# EAGLE design TestRig1a (EAGLE 7.5.0)

## Sheet 1 of 2
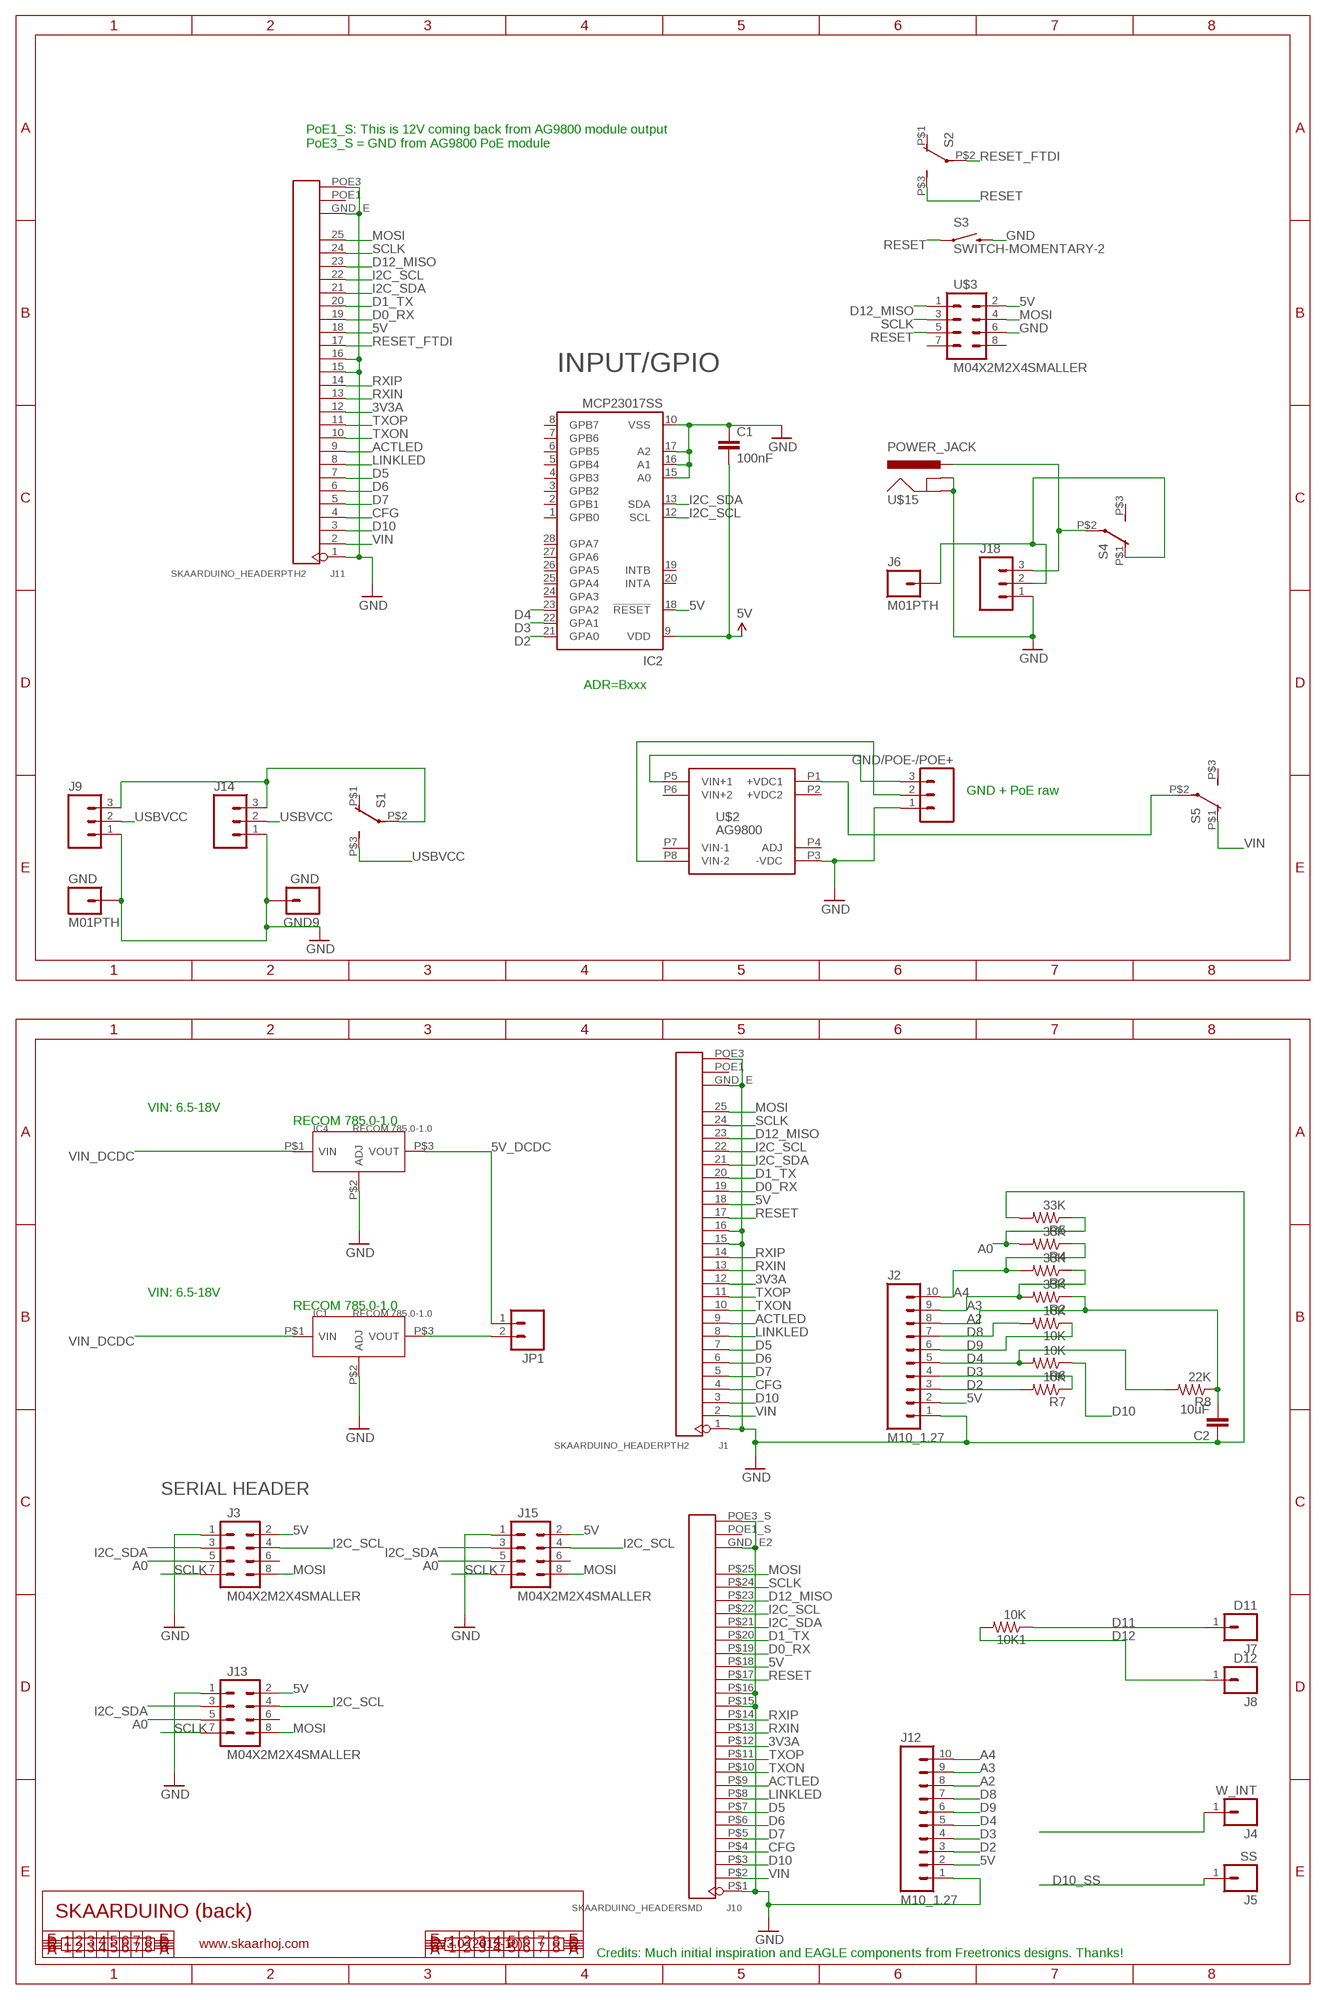
[diagram p0: schematic, sheet 1]

### Parts
10K  10K  RESISTOR0603-RES  [0603-RES]
10K1  10K  RESISTOR0603-RES  [0603-RES]
C1  100nF  CAP0603-CAP  [0603-CAP]
C2  10uF  CAP0805  [0805]
GND  M01PTH  [1X01]
GND9  GND  M01PTH  [1X01]
GND/POE-/POE+  M03LOCK  [1X03_LOCK]
IC1  RECOM 785.0-1.0  PMIC-LM317EMP  [RECOM_785.0-1.0]
IC2  MCP23017SS  [SSOP28]
IC4  RECOM 785.0-1.0  PMIC-LM317EMP  [RECOM_785.0-1.0]
J1  SKAARDUINO_HEADERPTH2  [SKAARDUINO_PTH_HEADER2]
J2  M10_1.27  [M10X1]
J3  M04X2M2X4SMALLER  [M2X4SMALLER]
J4  W_INT  M1X1TEST  [M1X1]
J5  SS  M1X1TEST  [M1X1]
J6  M01PTH  [1X01]
J7  D11  M1X1TEST  [M1X1]
J8  D12  M1X1TEST  [M1X1]
J9  M03LOCK  [1X03_LOCK]
J10  SKAARDUINO_HEADERSMD  [SKAARDUINO_SMD_HEADER]
J11  SKAARDUINO_HEADERPTH2  [SKAARDUINO_PTH_HEADER2]
J12  M10_1.27  [M10X1]
J13  M04X2M2X4SMALLER  [M2X4SMALLER]
J14  M03LOCK  [1X03_LOCK]
J15  M04X2M2X4SMALLER  [M2X4SMALLER]
J18  M03LOCK  [1X03_LOCK]
JP1  M02PTH  [1X02]
R2  33K  RESISTOR0603-RES  [0603-RES]
R3  33K  RESISTOR0603-RES  [0603-RES]
R4  33K  RESISTOR0603-RES  [0603-RES]
R5  33K  RESISTOR0603-RES  [0603-RES]
R6  10K  RESISTOR0603-RES  [0603-RES]
R7  10K  RESISTOR0603-RES  [0603-RES]
R8  22K  RESISTOR0603-RES  [0603-RES]
S1  SWITCH-DPST  [TECONNECTIVITY-DPST]
S2  SWITCH-DPST  [TECONNECTIVITY-DPST]
S3  SWITCH-MOMENTARY-2  [TACTILE_SWITCH_TALL]
S4  SWITCH-DPST  [TECONNECTIVITY-DPST]
S5  SWITCH-DPST  [TECONNECTIVITY-DPST]
U$2  AG9800  [AG9800]
U$3  M04X2M2X4SMALLER  [M2X4SMALLER]
U$15  POWER_JACK  [POWER_JACK_SMD]

### Nets
3V3A [power]: J1.12 J10.P$12 J11.12
5V [power]: C1.2 IC2.9(VDD) IC2.18(!RESET) J1.18 J2.2 J3.2 J10.P$18 J11.18 J12.2 J13.2 J15.2 U$3.2
5V_DCDC [power]: IC4.P$3(VOUT) JP1.1
A0: J3.5 J13.5 J15.5 R4.2 R5.1
A2: C2.2 J2.8 J12.8 R2.1 R8.1
A3: J2.9 J12.9 R2.2 R3.1
A4: J2.10 J12.10 R3.2 R4.1
ACTLED: J1.9 J10.P$9 J11.9
CFG: J1.4 J10.P$4 J11.4
D0_RX: J1.19 J10.P$19 J11.19
D1_TX: J1.20 J10.P$20 J11.20
D2: IC2.21(GPA0) J2.3 J12.3 R7.2
D3: IC2.22(GPA1) J2.4 J12.4 R7.1
D4: IC2.23(GPA2) J2.5 J12.5 R6.2 R8.2
D5: J1.7 J10.P$7 J11.7
D6: J1.6 J10.P$6 J11.6
D7: J1.5 J10.P$5 J11.5
D8: 10K.2 J2.7 J12.7
D9: 10K.1 J2.6 J12.6
D10: J1.3 J10.P$3 J11.3 R6.1
D10_SS: J5.1
D11: 10K1.1 J7.1
D12: 10K1.2 J8.1
D12_MISO: J1.23 J10.P$23 J11.23 U$3.1
GND [power]: C1.1 C2.1 GND9.1 GND.1 GND/POE-/POE+.1 IC1.P$2(ADJ) IC2.10(VSS) IC2.15(A0) IC2.16(A1) IC2.17(A2) IC4.P$2(ADJ) J1.1 J1.15 J1.16 J1.GND_E J1.POE3 J2.1 J3.1 J9.1 J10.GND_E2 J10.P$1 J10.P$15 J10.P$16 J10.POE3_S J11.1 J11.15 J11.16 J11.GND_E J11.POE3 J12.1 J13.1 J14.1 J15.1 J18.1 R5.2 S3.B2 U$2.P3(-VDC) U$3.6 U$15.GND U$15.SHUNT(GNDBREAK)
I2C_SCL: IC2.12(SCL) J1.22 J3.4 J10.P$22 J11.22 J13.4 J15.4
I2C_SDA: IC2.13(SDA) J1.21 J3.3 J10.P$21 J11.21 J13.3 J15.3
LINKLED: J1.8 J10.P$8 J11.8
MOSI: J1.25 J3.8 J10.P$25 J11.25 J13.8 J15.8 U$3.4
N$2 [VIN]: J18.3 S4.P$2(P) U$15.PWR
N$3: J4.1
N$5 [VIN]: S5.P$2(P) U$2.P1(+VDC1)
N$6 [power]: IC1.P$3(VOUT) JP1.2
N$7 [VIN]: GND/POE-/POE+.2 U$2.P8(VIN-2)
N$8 [VIN]: GND/POE-/POE+.3 U$2.P5(VIN+1)
N$9 [power]: J9.3 J14.3 S1.P$2(P)
N$13 [VIN]: J6.1 J18.2 S4.P$1(O)
RESET: J1.17 J10.P$17 S2.P$3(S) S3.A2 U$3.5
RESET_FTDI: J11.17 S2.P$2(P)
RXIN: J1.13 J10.P$13 J11.13
RXIP: J1.14 J10.P$14 J11.14
SCLK: J1.24 J3.7 J10.P$24 J11.24 J13.7 J15.7 U$3.3
TXON: J1.10 J10.P$10 J11.10
TXOP: J1.11 J10.P$11 J11.11
USBVCC [VIN]: J9.2 J14.2 S1.P$3(S)
VIN [VIN]: J1.2 J10.P$2 J11.2 S5.P$1(O)
VIN_DCDC [VIN]: IC1.P$1(VIN) IC4.P$1(VIN)
Unconnected: IC2.1(GPB0) IC2.2(GPB1) IC2.3(GPB2) IC2.4(GPB3) IC2.5(GPB4) IC2.6(GPB5) IC2.7(GPB6) IC2.8(GPB7) IC2.19(INTB) IC2.20(INTA) IC2.24(GPA3) IC2.25(GPA4) IC2.26(GPA5) IC2.27(GPA6) IC2.28(GPA7) J1.POE1 J3.6 J10.POE1_S J11.POE1 J13.6 J15.6 S1.P$1(O) S2.P$1(O) S4.P$3(S) S5.P$3(S) U$2.P2(+VDC2) U$2.P4(ADJ) U$3.7 U$3.8

### Notes on the sheet
- PoE1_S: This is 12V coming back from AG9800 module output
  PoE3_S = GND from AG9800 PoE module
- INPUT/GPIO
- ADR=Bxxx
- GND + PoE raw
- VIN: 6.5-18V
- RECOM 785.0-1.0
- VIN: 6.5-18V
- RECOM 785.0-1.0
- SERIAL HEADER
- SKAARDUINO (back)
- www.skaarhoj.com | V3.0 (2015-10)
- Credits: Much initial inspiration and EAGLE components from Freetronics designs. Thanks!

## Sheet 2 of 2

## Power pins joined to a net without a drawn wire
VIN+2: U$2.P6(VIN+2)
VIN-1: U$2.P7(VIN-1)

## Library data of the parts
10K 10K1 R2-R8 = SparkFun:RESISTOR: Resistor Basic schematic elements and footprints for 0603, 1206, and PTH resistors.
C1 C2 = SparkFun:CAP: Capacitor Standard 0603 ceramic capacitor, and 0.1" leaded capacitor.
GND GND9 J6 = SparkFun:M01: Header 1 Standard 1-pin 0.1" header. Use with straight break away headers (SKU : PRT-00116), right angle break away headers (PRT-00553), swiss pins (PRT-00743), machine pins (PRT-00117), and female headers (PRT-00115).
GND/POE-/POE+ J9 J14 J18 = SparkFun:M03: Header 3 Standard 3-pin 0.1" header. Use with straight break away headers (SKU : PRT-00116), right angle break away headers (PRT-00553), swiss pins (PRT-00743), machine pins (PRT-00117), and female headers (PRT-00115). Molex polarized connector foot print use with SKU : PRT-08232 with associated crimp pins and housings.
IC1 IC4 = SKAARHOJ:PMIC-LM317EMP: 3-Terminal Adjustable Regulator
IC2 = microchip:MCP23017: http://ww1.microchip.com/downloads/en/DeviceDoc/21952a.pdf Source: http://ww1.microchip.com/downloads/en/DeviceDoc/21952a.pdf; MF: MICROCHIP; MPN: MCP23017-E/SS; OC_FARNELL: 1467674; OC_NEWARK: 31K2960
J1 J10 J11 = SKAARHOJ:SKAARDUINO_HEADER
J2 J12 = SKAARHOJ:M10_1.27
J3 J13 J15 U$3 = SKAARHOJ:M04X2
J4 J5 J7 J8 = SKAARHOJ:M1X1
JP1 = SparkFun:M02: Header 2 Standard 2-pin 0.1" header. Use with straight break away headers (SKU : PRT-00116), right angle break away headers (PRT-00553), swiss pins (PRT-00743), machine pins (PRT-00117), and female headers (PRT-00115). Molex polarized connector foot print use with SKU : PRT-08233 with associated crimp pins and housings.
S1 S2 S4 S5 = SKAARHOJ:SWITCH-DPST: DPDT Version of the COM-00597
S3 = SparkFun:SWITCH-MOMENTARY-2
U$2 = SKAARHOJ:AG9800
U$15 = SKAARHOJ:POWER_JACK: RASM712PX Right Angle SMT Mount DC Power Jack, pin size 0.100"(2.5mm), with locating post Switchcraft.com

## Net classes
0 default: width 0.254 mm, clearance 0.152 mm
1 power: width 0.406 mm, clearance 0.152 mm
2 VIN: width 0.406 mm, clearance 0.406 mm

## Board
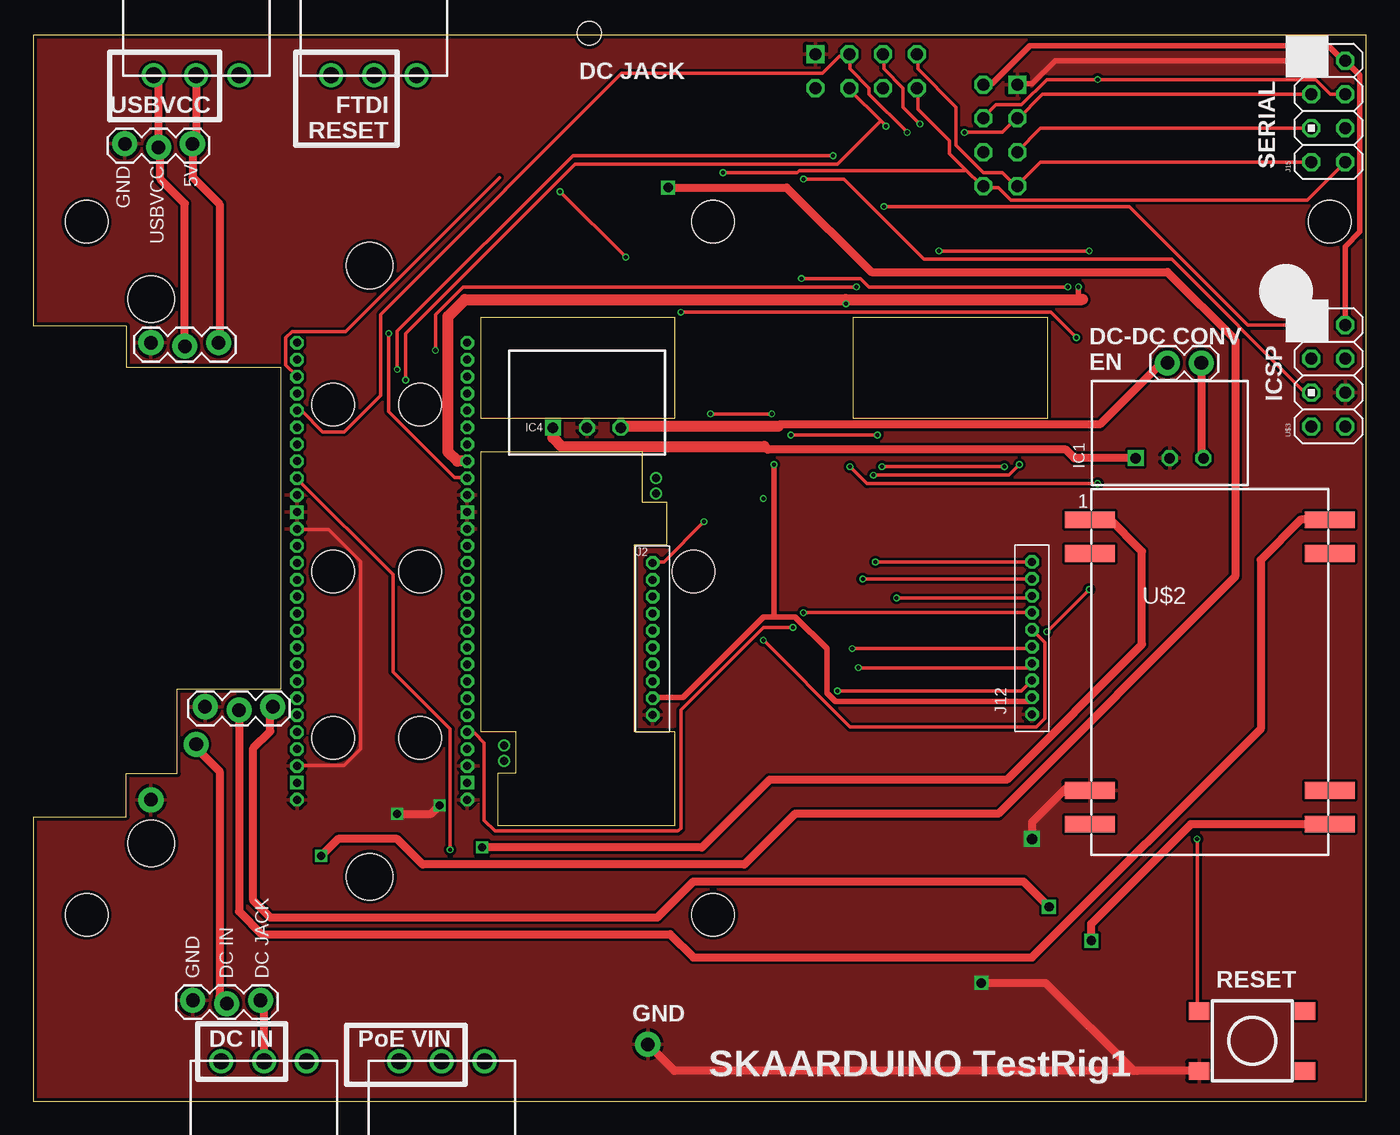
[diagram p1: board, top side]
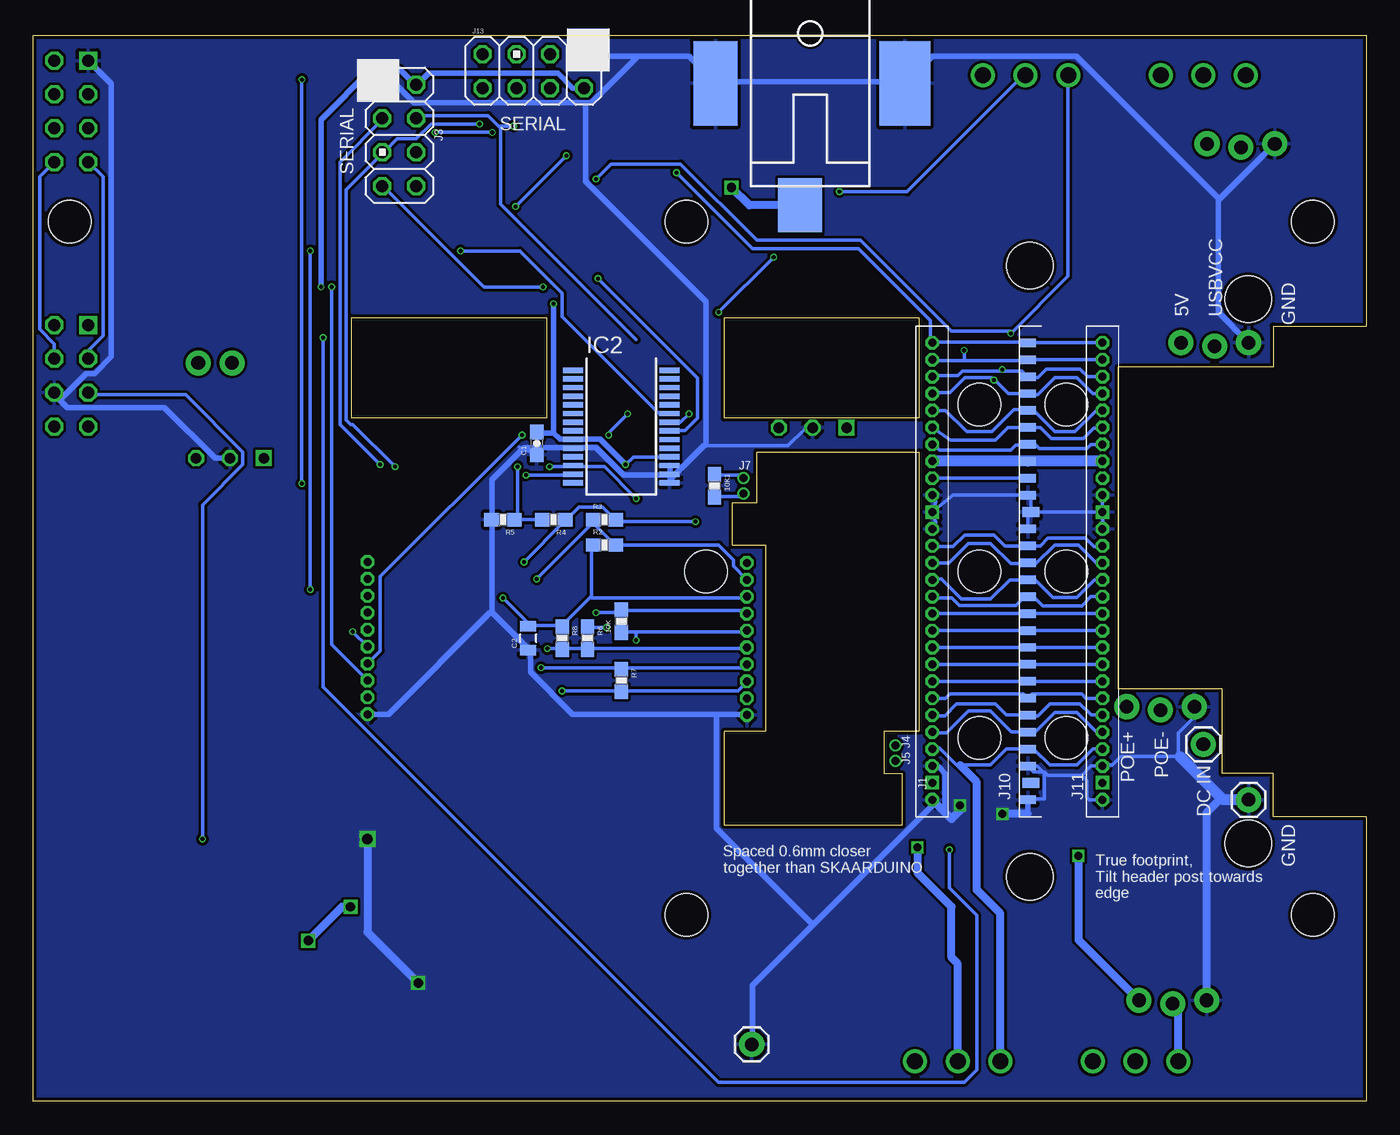
[diagram p2: board, bottom side, seen from below]

Size 100 x 80 mm. Coordinates in mm from the lower left corner, seen from the top.
Outline: 34.83,20.73 48.16,20.73 48.16,27.78 45.09,27.78 45.09,41.75 47.53,41.75 47.53,44.92 45.72,44.92 45.72,48.73 33.56,48.73 33.56,27.78 36.2,27.78 36.2,24.61 34.83,24.61 34.83,20.73
Outline: 48.16,58.83 33.56,58.83 33.56,51.27 48.16,51.27 48.16,58.83
Outline: 0,21.36 6.99,21.36 6.99,24.61 10.79,24.61 10.79,30.95 18.6,30.95 18.6,55.09 6.99,55.09 6.99,58.19 0,58.19 0,80 100,80 100,0 0,0 0,21.36
Outline: 76.1,58.83 61.5,58.83 61.5,51.27 76.1,51.27 76.1,58.83
Copper layers (1*2*15*16): Top 0.035mm / dielectric 0.2mm / GND 0.0175mm / dielectric 0.3mm / 5V 0.0175mm / dielectric 0.2mm / Bottom 0.035mm
Design rules "SeeedStudio_4layer_DRU_no_angle_20140221": minimum track width 8mil, minimum drill 12mil, track to track 8mil, track to pad 8mil, pad to pad 8mil, via to via 8mil, smd to smd 0mil, copper to edge 10mil, drill to drill 8mil, minimum pad ring 6mil, minimum via ring 4mil, stop-mask expansion 4mil, vias tented up to drill 100mil, thermal gap 10mil
Holes 3.2 mm at 4,14 4,66 51,66 51,14 22.51,52.27 29.01,52.27 22.51,39.77 29.01,39.77 22.51,27.27 29.01,27.27 49.52,39.77 97.28,66
Holes 3.5 mm at 8.86,19.36 8.86,60.2 25.24,62.7 25.24,16.86
tKeepout: area 0,0 to 3.3,36.8

### Footprints (pad centres in the part's own frame; a part is rotated, then mirrored left to right if it is on the bottom)
0603-RES = smd 1.1 x 1: 1 -0.85,0; 2 0.85,0
0603-CAP = smd 1.1 x 1: 1 -0.85,0; 2 0.85,0
0805 = smd 0.8 x 1.2: 1 -0.9,0; 2 0.9,0
1X01 = drill 1.016 pad 1.88: 1 0,0
1X03_LOCK = drill 1.016 pad 1.88: 1 0,0.127; 2 2.54,-0.127; 3 5.08,0.127
RECOM_785.0-1.0 = drill 0.8 square: P$1 -2.54,0 | drill 0.8 octagon: P$2 0,0; P$3 2.54,0
SSOP28 = smd 0.4 x 1.5: 1 -4.225,-3.625; 2 -3.575,-3.625; 3 -2.925,-3.625; 4 -2.275,-3.625; 5 -1.625,-3.625; 6 -0.975,-3.625; 7 -0.325,-3.625; 8 0.325,-3.625; 9 0.975,-3.625; 10 1.625,-3.625; 11 2.275,-3.625; 12 2.925,-3.625; 13 3.575,-3.625; 14 4.225,-3.625; 15 4.225,3.625; 16 3.575,3.625; 17 2.925,3.625; 18 2.275,3.625; 19 1.625,3.625; 20 0.975,3.625; 21 0.325,3.625; 22 -0.325,3.625; 23 -0.975,3.625; 24 -1.625,3.625; 25 -2.275,3.625; 26 -2.925,3.625; 27 -3.575,3.625; 28 -4.225,3.625
SKAARDUINO_PTH_HEADER2 = drill 0.6 pad 1.016 octagon: 1 -1.75,3.81; 2 -1.75,5.08; 3 -1.75,6.35; 4 -1.75,7.62; 5 -1.75,8.89; 6 -1.75,10.16; 7 -1.75,11.43; 8 -1.75,12.7; 9 -1.75,13.97; 10 -1.75,15.24; 11 -1.75,16.51; 12 -1.75,17.78; 13 -1.75,19.05; 14 -1.75,20.32; 15 -1.75,21.59; 16 -1.75,24.13; 17 -1.75,25.4; 18 -1.75,26.67; 19 -1.75,27.94; 20 -1.75,29.21; 21 -1.75,30.48; 22 -1.75,31.75; 23 -1.75,33.02; 24 -1.75,34.29; 25 -1.75,35.56; GND_E -1.75,1.27 | drill 0.6 pad 1.016 square: POE1 -1.75,2.54; POE3 -1.75,22.86
M10X1 = drill 0.6 pad 1.016 octagon: 1 0,0; 2 0,1.27; 3 0,2.54; 4 0,3.81; 5 0,5.08; 6 0,6.35; 7 0,7.62; 8 0,8.89; 9 0,10.16; 10 0,11.43
M2X4SMALLER = drill 0.9 square: 1 -1.27,3.81 | drill 0.9 octagon: 2 1.27,3.81; 3 -1.27,1.27; 4 1.27,1.27; 5 -1.27,-1.27; 6 1.27,-1.27; 7 -1.27,-3.81; 8 1.27,-3.81
M1X1 = drill 0.6 pad 0.813: 1 0,0
SKAARDUINO_SMD_HEADER = smd 1.27 x 0.635: GND_E2 0.635,1.27; P$1 0.635,3.81; P$2 0.635,5.08; P$3 0.635,6.35; P$4 0.635,7.62; P$5 0.635,8.89; P$6 0.635,10.16; P$7 0.635,11.43; P$8 0.635,12.7; P$9 0.635,13.97; P$10 0.635,15.24; P$11 0.635,16.51; P$12 0.635,17.78; P$13 0.635,19.05; P$14 0.635,20.32; P$15 0.635,21.59; P$16 0.635,24.13; P$17 0.635,25.4; P$18 0.635,26.67; P$19 0.635,27.94; P$20 0.635,29.21; P$21 0.635,30.48; P$22 0.635,31.75; P$23 0.635,33.02; P$24 0.635,34.29; P$25 0.635,35.56 | smd 1.27 x 0.762: POE1_S 0.889,2.54; POE3_S 0.889,22.86
1X02 = drill 1.016 pad 1.88: 1 0,0; 2 2.54,0
TECONNECTIVITY-DPST = drill 1.2: P$1 3,3.2; P$2 3,0; P$3 3,-3.2
TACTILE_SWITCH_TALL = smd 1.55 x 1.3: A1 -3.975,-2.25; A2 3.975,-2.25; B1 -3.975,2.25; B2 3.975,2.25
AG9800 = smd 3.75 x 1.25: P1 -9,11.43; P2 -9,8.89; P3 -9,-8.89; P4 -9,-11.43; P5 9,-11.43; P6 9,-8.89; P7 9,8.89; P8 9,11.43
POWER_JACK_SMD = smd 6.35 x 3.81: GND -6.756,-7.112 | smd 4.064 x 3.302: PWR -15.9,0.762 | smd 6.35 x 3.302: SHUNT -6.756,7.112 | hole 1.778: -2.997,0

### Placement (x,y rotation side)
10K  55.88,36.03 90 bottom
10K1  48.9,46.2 270 bottom
C1  62.23,49.37 90 bottom
C2  62.87,34.77 90 bottom
GND  8.82,22.63 0 bottom
GND9  46.1,4.29 0 bottom
GND/POE-/POE+  12.89,29.49 0 top
IC1  85.25,48.26 0 top
IC2  55.88,50.64 270 bottom
IC4  41.53,50.55 0 top
J1  30.81,21.36 0 bottom
J2  46.46,28.98 0 top
J3  72.54,72.49 0 bottom
J4  35.33,26.7 0 top
J5  35.33,25.55 0 bottom
J6  12.22,26.8 0 bottom
J7  46.72,46.76 0 top
J8  46.72,45.62 0 top
J9  8.82,56.8 0 top
J10  26.04,21.36 0 bottom
J11  18.03,21.36 0 bottom
J12  74.93,29.05 0 top
J13  62.48,77.31 270 bottom
J14  6.86,71.72 0 top
J15  97.16,74.3 0 top
J18  11.97,7.46 0 top
JP1  85.09,55.41 0 top
R2  57.15,41.75 0 bottom
R3  57.15,43.66 0 bottom
R4  60.96,43.66 180 bottom
R5  64.77,43.66 180 bottom
R6  58.42,34.77 270 bottom
R7  55.88,31.59 270 bottom
R8  60.33,34.77 270 bottom
S1  12.22,80 270 top
S2  25.56,80 270 top
S3  91.44,4.54 180 top
S4  17.31,0 90 top
S5  30.64,0 90 top
U$2  88.27,32.23 0 top
U$3  97.16,54.45 0 top
U$15  41.71,83.14 90 bottom

### Tracks (layer width: path | path; a pad name or v marks a point on that pad's centre or on a via)
3V3A
  Bottom 0.254: J11.12 20.39,39.14 21.72,37.81 23.5,37.81 24.77,39.08 25.34,39.08 J10.P$12 26.74,39.14 28.19,37.69 30.35,37.69 31.88,39.21 32.7,39.21 J1.12
5V  (via drill 0.3)
  Top 0.254: 46.86,30.23 J2.2
  Top 0.406: v60.96,59.85 60.96,60.16 | 55.56,36.35 57.15,36.35 59.53,33.97 59.53,30.64 60.17,30 74.77,30 74.93,30.16 J12.2 | 55.56,36.35 54.77,36.35 48.74,30.32 46.83,30.32 J2.2 | 55.56,36.35 v55.56,47.78 | U$3.2 98.42,64.14 99.54,65.25 99.54,76.99 J15.2 98.27,78.11 97.16,79.22 74.77,79.22 71.91,76.36 71.28,76.36 J3.2 | v78.42,61.12 78.42,60.16
  Top 0.813: J1.18 31.82,48.03 31.11,48.73 31.11,58.9 32.38,60.16 60.96,60.16 78.42,60.16 78.71,60.16
  Bottom 0.254: IC2.18 54.98,48.37 v55.56,47.78
  Bottom 0.406: 60.96,50.16 62.23,50.16 C1.2 | 60.96,50.16 60.48,49.69 59.53,49.69 IC2.9 59.37,49.69 57.47,49.69 v55.56,47.78 | v60.96,59.85 60.96,50.16 | J13.2 58.74,76.04 59.53,76.04 60.64,77.15 70.33,77.15 71.12,76.36 J3.2 71.44,76.36 72.55,77.47 74.61,77.47 78.42,73.66 v78.42,61.12
  Bottom 0.813: J11.18 J10.P$18 J1.18
5V_DCDC
  Top 0.61: JP1.1 84.61,55.41 80.01,50.8 56.04,50.8 55.88,50.64
  Top 0.813: 55.88,50.64 44.16,50.64 IC4.P$3
A0  (via drill 0.3)
  Top 0.254: v72.87,47.62 v63.66,47.62 | v66.52,73.34 65.25,74.61 65.25,76.04 63.82,77.47 63.82,78.42 J13.5 | J15.5 75.56,73.03 73.82,71.28 J3.5
  Bottom 0.254: 63.66,43.66 63.82,43.66 R5.1 63.66,43.66 | 63.66,43.66 61.91,43.66 R4.2 | v63.66,47.62 63.66,43.66 | v72.87,47.62 76.04,50.8 76.2,50.8 76.52,51.12 76.52,68.42 73.82,71.12 J3.5 73.66,71.28 72.71,72.23 71.28,72.23 70.17,73.34 v66.52,73.34
A2  (via drill 0.3)
  Top 0.254: 46.86,37.77 J2.8 | v64.77,37.78 74.93,37.78 J12.8
  Bottom 0.254: 62.71,35.72 62.87,35.72 C2.2 62.71,35.72 | 62.71,35.72 60.33,35.72 | 60.33,35.72 58.18,37.86 | 58.18,37.86 58.1,37.94 58.1,41.59 R2.1 | 60.33,35.72 R8.1 | J2.8 46.51,37.78 58.1,37.78 58.18,37.86 | 62.71,35.72 v64.77,37.78
A3  (via drill 0.3)
  Top 0.254: v62.23,39.21 J12.9
  Bottom 0.254: J2.9 46.51,39.21 47.47,40.16 47.47,40.64 48.58,41.75 56.2,41.75 R2.2 56.36,41.75 58.1,43.5 R3.1 58.1,43.34 v62.23,39.21
A4  (via drill 0.3)
  Top 0.254: v50.32,43.5 47.31,40.48 46.51,40.48 J2.10 | v63.18,40.48 J12.10
  Bottom 0.254: v50.32,43.5 56.2,43.5 R3.2 56.36,43.66 57.31,44.61 59.05,44.61 60.01,43.66 R4.1 60.17,43.5 v63.18,40.48
ACTLED
  Bottom 0.254: J1.9 J10.P$9 J11.9
CFG
  Bottom 0.254: J11.4 20.64,28.98 21.46,29.81 23.75,29.81 24.64,28.92 25.34,28.92 J10.P$4 26.98,28.98 27.81,29.81 30.73,29.81 31.62,28.92 32.7,28.92 J1.4
D0_RX
  Bottom 0.254: J11.19 20.64,49.3 20.95,48.99 24.51,48.99 24.89,49.37 25.33,49.37 J10.P$19 25.46,49.24 26.29,49.24 26.67,48.86 32,48.86 32.45,49.3 J1.19
D1_TX
  Bottom 0.254: J11.20 19.91,50.51 20.45,50.51 21.21,49.75 23.62,49.75 24.45,50.57 J10.P$20 26.86,50.57 27.81,49.62 31.18,49.62 J1.20
D2  (via drill 0.3)
  Top 0.254: 46.86,31.49 J2.3 | v57.63,61.75 62.07,61.75 62.71,61.12 v77.63,61.12 | v60.33,30.8 74.14,30.8 J12.3
  Bottom 0.254: 55.88,30.8 47.15,30.8 46.51,31.43 J2.3 | v57.63,61.75 50.16,54.29 50.16,51.28 51.12,50.32 52.23,50.32 IC2.21 | v77.63,61.12 77.63,34.29 J12.3 | v60.33,30.8 55.88,30.8 | 55.88,30.8 R7.2
D3  (via drill 0.3)
  Top 0.254: 46.86,32.86 J2.4 | v55.4,51.59 v50.8,51.59 | v63.34,50.01 v56.83,50.01 | v61.91,32.54 74.77,32.54 74.93,32.7 J12.4
  Bottom 0.254: 55.88,32.54 46.67,32.54 46.51,32.7 J2.4 | v50.8,51.59 51.44,50.96 52.23,50.96 IC2.22 | v55.4,51.59 56.83,50.16 v56.83,50.01 | v63.34,50.01 73.98,39.37 73.98,33.81 J12.4 | v61.91,32.54 55.88,32.54 | 55.88,32.54 R7.1
D4  (via drill 0.3)
  Top 0.254: 46.86,34.12 J2.5 | v61.44,33.97 74.93,33.97 J12.5 | v79.22,63.82 v67.94,63.82 | v76.04,35.24 v79.22,38.42
  Bottom 0.254: 60.33,33.97 58.42,33.97 | 58.42,33.97 46.51,33.97 J2.5 | 58.42,33.97 R6.2 | 60.33,33.97 v61.44,33.97 | 60.33,33.97 R8.2 | v67.94,63.82 63.5,63.82 60.33,60.64 60.33,58.9 53.02,51.59 52.39,51.59 IC2.23 | v79.22,38.42 v79.22,63.82 | v76.04,35.24 J12.5
D5
  Bottom 0.254: J1.7 J10.P$7 J11.7
D6
  Bottom 0.254: J11.6 J10.P$6 J1.6
D7
  Bottom 0.254: J11.5 21.02,30.25 21.34,30.57 25.08,30.57 J10.P$5 25.72,30.57 31.24,30.57 31.56,30.25 J1.5
D8  (via drill 0.3)
  Top 0.254: 46.86,36.63 J2.7 | v57.78,36.67 J12.7
  Bottom 0.254: 55.88,36.83 46.67,36.83 46.51,36.67 J2.7 | v57.78,36.67 56.04,36.67 55.88,36.83 | 55.88,36.83 10K.2
D9  (via drill 0.3)
  Top 0.254: 46.86,35.38 J2.6 | v54.77,34.61 61.28,28.1 75.25,28.1 75.88,28.73 75.88,34.45 75.09,35.24 74.93,35.24 J12.6
  Bottom 0.254: 54.77,35.24 46.51,35.24 J2.6 | 54.77,35.24 55.88,35.24 10K.1 | 54.77,35.24 v54.77,34.61
D10  (via drill 0.3)
  Top 0.254: J1.3 32.8,27.6 33.15,27.6 33.83,26.92 33.83,21.09 34.63,20.29 48.35,20.29 48.42,20.32 48.58,20.48 48.58,29.37 54.77,35.56 v56.99,35.56
  Bottom 0.254: J11.3 20.25,27.71 21.72,29.18 23.37,29.18 24.77,27.78 25.33,27.78 J10.P$3 26.6,27.71 28.19,29.3 29.84,29.3 31.5,27.65 32.7,27.65 J1.3 | v56.99,35.56 58.42,35.56 R6.1
D11
  Bottom 0.254: 10K1.1 48.9,46.99 46.99,46.99 46.83,46.83 J7.1
D12
  Bottom 0.254: 10K1.2 48.9,45.4 46.99,45.4 46.83,45.56 J8.1
D12_MISO  (via drill 0.3)
  Top 0.254: 34.98,69.32 23.43,57.78 19.43,57.78 18.92,57.32 18.92,55.26 19.77,54.46 J11.23 | v63.82,67.15 82.23,67.15 91.12,58.26 U$3.1 | v60.01,70.96 40.48,70.96 27.3,57.78 v27.3,54.93
  Bottom 0.254: J11.23 20.89,54.38 21.46,54.96 24,54.96 24.64,54.32 25.34,54.32 J10.P$23 25.49,54.46 25.83,54.81 27.3,54.81 | 27.3,54.81 30.29,54.81 30.63,54.46 32.69,54.46 J1.23 | v60.01,70.96 v63.82,67.15 | v27.3,54.93 27.3,54.81
GND  (via drill 0.6, 0.7, 0.8)
  Top 0.254: J11.15 19.89,42.92 22.17,42.92 24.57,40.52 24.57,26.46 23.32,25.2 19.89,25.2 J11.1
  Top 0.406: J15.1 76.68,78.11 74.93,76.36 73.82,76.36 J3.1
  Top 0.61: 82.55,2.29 S3.B2 82.8,2.29 | 82.55,2.29 48.1,2.29 GND9.1 | U$2.P3 79.11,23.5 77.47,23.5 74.93,20.95 v74.93,19.68 | v71.12,8.89 75.95,8.89 82.55,2.29 | v27.3,21.59 29.84,21.59 v30.48,22.23
  Bottom 0.254: 21.34,24.48 20.64,25.17 J11.1 19.78,25.24 19.05,25.24 18.41,25.88 13.97,25.88 14.1,26 14.1,27.65 12.89,28.86 GND/POE-/POE+.1 | 21.34,24.48 23.88,24.48 24.13,24.73 24.96,24.73 J10.P$1 24.7,25.17 24.13,24.61 24.13,22.7 25.33,22.7 J10.GND_E2 | J11.GND_E 20.76,22.63 20.95,22.83 20.95,24.1 21.34,24.48 | J11.16 J11.POE3 | J11.POE3 19.75,43.05 J11.15 | J11.POE3 J10.POE3_S | J10.POE3_S 25.15,45.24 J10.P$16 31.02,45.49 J1.POE3 | J10.P$15 25.4,43.97 J10.POE3_S | J1.POE3 32.29,45.01 J1.16 | J1.POE3 32.29,43.43 J1.15 | 63.55,49.09 63.3,48.98 63.23,48.95 C1.1 | 49.61,49.2 43.37,49.2 42.11,50.46 41.6,50.46 IC4.P$2
  Bottom 0.406: J1.1 32.54,25.08 32.07,25.08 31.59,24.61 31.59,22.07 31.79,21.87 | J10.GND_E2 25.4,21.59 | 41.51,13.26 46.04,8.73 46.04,4.29 GND9.1 | 41.51,13.26 32.54,22.23 J1.GND_E | 52.23,46.83 52.23,46.99 IC2.16 | 52.23,46.83 52.23,46.51 IC2.15 | IC2.17 52.23,47.62 52.23,47.15 IC2.16 | IC2.16 52.39,46.99 55.72,46.99 57.78,49.05 59.37,49.05 IC2.10 59.69,49.05 63.18,49.05 63.23,48.95 | 52.23,46.83 52.07,46.83 49.69,49.21 49.61,49.2 49.53,49.37 49.53,60.01 58.58,69.06 58.58,74.93 | 63.3,48.98 63.34,48.9 65.56,46.67 65.56,43.66 R5.2 65.56,43.5 65.56,36.67 | 65.56,36.67 62.87,33.97 C2.1 62.71,33.81 62.71,32.23 59.53,29.05 48.74,29.05 | 48.74,29.05 46.51,29.05 J2.1 | J12.1 73.34,29.05 65.72,36.67 65.56,36.67 | 41.51,13.26 48.74,20.48 48.74,29.05 | IC1.P$2 86.36,48.26 90.17,52.07 97.47,52.07 98.42,53.02 U$3.6 97.95,52.7 96.04,54.61 95.41,54.61 94.14,55.88 94.14,76.36 J15.1 | 11.11,67.63 11.11,59.21 8.89,56.99 J9.1 | 11.11,67.63 6.99,71.75 J14.1 | 54.77,78.42 50.8,78.42 48.9,76.52 U$15.SHUNT 48.74,76.52 34.61,76.52 U$15.GND 34.45,76.52 32.54,78.42 21.75,78.42 11.11,67.79 11.11,67.63 | 54.77,78.42 58.58,78.42 J13.1 | 58.58,74.93 58.1,74.93 54.77,78.26 54.77,78.42 | 58.58,74.93 71.44,74.93 72.71,76.2 73.66,76.2 J3.1
  Bottom 0.61: J18.1 11.97,21.68 10.88,22.78 | J1.GND_E 31.79,21.87 31.11,21.19 30.48,21.83 v30.48,22.23 | v74.93,19.68 74.93,12.7 v71.12,8.89 | 25.4,21.59 v27.3,21.59
  Bottom 0.813: GND.1 10.73,22.63 10.88,22.78 13.97,25.88
  pour Top: 0,0 100.33,0 100.33,80.01 0,80.01
  pour Bottom: 0,0 100.33,0 100.33,80.01 0,80.01
I2C_SCL  (via drill 0.3)
  Top 0.254: J15.4 97.31,75.56 96.2,76.68 v79.85,76.68 76.04,76.68 74.14,74.77 72.23,74.77 71.28,73.82 J3.4 | v63.98,73.18 63.58,73.58 | 63.58,73.58 61.28,75.88 J13.4 | v27.94,54.13 27.94,57.63 40.64,70.33 60.33,70.33 63.58,73.58 | v61.28,47.62 62.55,46.35 v79.85,46.35
  Bottom 0.254: J11.22 20.51,53.11 21.72,54.32 23.37,54.32 24.64,53.05 25.34,53.05 J10.P$22 26.86,53.11 27.91,54.16 | 27.91,54.16 28.07,54.32 30.1,54.32 31.24,53.18 32.7,53.18 J1.22 | v54.77,45.24 57.15,47.62 59.37,47.62 IC2.12 59.53,47.62 v61.28,47.62 | 54.77,57.15 64.93,67.31 64.93,73.03 65.01,73.1 | 65.01,73.1 65.88,73.98 70.96,73.98 71.12,73.82 J3.4 | v63.98,73.18 64.93,73.18 65.01,73.1 | v27.94,54.13 27.91,54.16 | v79.85,76.68 v79.85,46.35
I2C_SDA  (via drill 0.3)
  Top 0.254: 35.43,68.41 35.42,68.4 | 35.42,68.4 26.06,59.03 26.06,52.98 23.32,50.23 21.72,50.23 20.12,51.83 19.89,51.83 J11.21 | 35.42,68.4 35.4,68.42 44.13,77.15 59.21,77.15 60.48,78.42 61.12,78.42 J13.3 61.28,78.42 61.28,77.47 62.71,76.04 62.71,75.56 v65.56,72.71 | v63.02,46.99 73.18,46.99 v73.98,47.78 | J15.3 75.72,75.56 73.82,73.66 J3.3 73.66,73.66 72.71,72.71 v69.85,72.71
  Bottom 0.254: J11.21 20.26,51.84 21.84,50.26 23.37,50.26 24.89,51.78 25.34,51.78 J10.P$21 25.47,51.91 26.42,51.91 28.07,50.26 29.97,50.26 31.56,51.84 J1.21 | v63.02,46.99 59.53,46.99 IC2.13 | v73.98,47.78 76.99,50.8 76.99,70.48 73.82,73.66 J3.3 | v69.85,72.71 v65.56,72.71
LINKLED
  Bottom 0.254: J11.8 J10.P$8 J1.8
MOSI  (via drill 0.3)
  Top 0.254: 69.93,69.93 71.12,68.74 J3.8 71.28,68.58 72.39,68.58 73.34,67.63 95.57,67.63 J15.8 | 69.93,69.93 68.74,71.12 68.74,72.07 66.36,74.45 66.36,75.88 J13.8 | v51.75,69.69 57.31,69.69 57.47,69.85 69.85,69.85 69.93,69.93
  Bottom 0.254: J11.25 J10.P$25 25.49,56.98 32.69,56.98 J1.25 32.69,57.09 32.69,58.58 38.06,63.95 38.1,63.98 46.04,63.98 v51.75,69.69 | U$3.4 98.42,56.83 99.54,57.94 99.54,69.37 J15.8
N$2  (via drill 0.6, 0.7)
  Top 0.61: S4.P$2 17.31,7.33 J18.3 | v47.62,68.58 56.52,68.58 62.87,62.23 85.09,62.23 90.17,57.15 90.17,39.37 72.39,21.59 57.15,21.59 53.34,17.78 29.21,17.78 27.3,19.68 22.86,19.68 v21.59,18.41
  Bottom 0.61: U$15.PWR 46.29,67.24 v47.62,68.58 | v21.59,18.41 21.59,12.13 J18.3
N$5  (via drill 0.6)
  Top 0.61: U$2.P1 79.42,43.81 80.64,43.81 83.19,41.27 83.19,34.29 73.03,24.13 55.24,24.13 50.16,19.05 v33.66,19.05
  Bottom 0.61: S5.P$2 30.64,10.32 31.11,10.79 31.11,14.61 33.66,17.14 v33.66,19.05
N$6
  Top 0.61: JP1.2 87.63,48.42 IC1.P$3
N$7
  Top 0.61: GND/POE-/POE+.2 15.43,14.26 17.14,12.54 47.78,12.54 49.53,10.79 74.93,10.79 92.08,27.94 92.08,40.64 95.09,43.66 U$2.P8
N$8  (via drill 0.7)
  Top 0.61: GND/POE-/POE+.3 17.78,29.43 17.78,27.78 16.51,26.51 16.51,15.08 17.78,13.81 46.83,13.81 49.53,16.51 74.3,16.51 v76.2,14.61 | U$2.P5 86.83,20.8 79.38,13.34 v79.38,12.06
  Bottom 0.61: v76.2,14.61 76.83,14.61 v79.38,12.06
N$9
  Top 0.61: S1.P$2 12.22,72.14 J14.3 11.94,69.34 13.97,67.31 13.97,56.99 J9.3
N$13
  Top 0.61: J6.1 12.22,26.52 13.97,24.77 13.97,7.87 J18.2
  Bottom 0.61: S4.P$1 14.11,6.93 J18.2
RESET  (via drill 0.3)
  Top 0.254: v26.67,57.63 26.67,51.75 31.59,46.83 32.54,46.83 J1.17 | v87.31,19.68 87.31,6.83 S3.A2 | v57.78,69.22 60.8,69.22 66.83,63.18 85.41,63.18 95.41,53.18 U$3.5
  Bottom 0.254: J10.P$17 J1.17 | S2.P$3 22.38,76.99 22.38,61.91 v26.67,57.63 26.67,57.78 31.11,57.78 37.94,64.61 45.72,64.61 51.44,70.33 56.67,70.33 v57.78,69.22 | v87.31,19.68 87.31,44.77 84.3,47.78 84.3,48.74 88.58,53.02 95.89,53.02 U$3.5
RESET_FTDI  (via drill 0.3)
  Top 0.254: v31.27,18.89 31.27,27.94 26.99,32.23 26.99,39.53 19.84,46.67 J11.17 | v78.26,57.31 76.36,59.21 v48.58,59.21 | v39.53,68.26 v44.45,63.34
  Bottom 0.254: v31.27,18.89 31.27,16.03 29.21,13.97 29.21,2.38 30.16,1.43 48.58,1.43 78.26,31.11 v78.26,57.31 | v44.45,63.34 v48.58,59.21 | v39.53,68.26 34.45,68.26 25.72,76.99 S2.P$2
RXIN
  Bottom 0.254: J11.13 20.25,40.41 21.59,41.75 23.37,41.75 24.77,40.35 25.34,40.35 J10.P$13 25.46,40.35 26.67,40.35 28.19,41.88 29.84,41.88 31.31,40.41 J1.13
RXIP
  Bottom 0.254: J1.14 32.7,41.62 30.99,41.62 30.1,42.51 27.94,42.51 27.11,41.68 J10.P$14 24.45,41.68 23.88,42.26 21.08,42.26 20.45,41.62 19.91,41.62 J11.14
SCLK  (via drill 0.3)
  Top 0.254: J13.7 66.36,78.42 66.36,77.47 69.22,74.61 69.22,71.75 71.28,69.69 72.71,69.69 73.66,68.74 J3.7 73.82,68.74 75.56,70.48 J15.7 | v30.16,56.36 30.16,59.05 32.23,61.12 v61.75,61.12
  Bottom 0.254: J11.24 J10.P$24 25.49,55.61 30.16,55.61 | 30.16,55.61 32.69,55.61 J1.24 | U$3.3 95.89,56.36 94.77,57.47 94.77,69.37 J15.7 | v30.16,56.36 30.16,55.61 | v61.75,61.12 66.2,61.12 73.66,68.58 J3.7
TXON
  Bottom 0.254: J11.10 J10.P$10 J1.10
TXOP
  Bottom 0.254: J11.11 20.64,37.87 21.34,37.18 24.26,37.18 24.89,37.81 25.34,37.81 J10.P$11 25.49,37.77 25.72,37.77 26.29,37.2 30.52,37.2 31.09,37.77 32.69,37.77 J1.11
USBVCC
  Top 0.61: J9.2 11.36,67.38 9.53,69.22 9.53,71.47 J14.2 9.4,76.63 S1.P$3
VIN
  Bottom 0.254: J11.2 20.51,26.44 21.72,25.24 23.75,25.24 24.89,26.38 25.34,26.38 J10.P$2 26.99,26.44 28.19,25.24 30.48,25.24 30.73,25.24 32,26.51 32.7,26.51 J1.2
  Bottom 0.61: S5.P$1 27.45,14.11 29.21,15.88 29.21,23.97 30.48,25.24
VIN_DCDC
  Top 0.61: IC1.P$1 78.11,48.26 77.47,48.9 55.09,48.9 54.84,49.14
  Top 0.813: IC4.P$1 38.99,49.8 39.65,49.14 54.84,49.14

### Text on the board
_tsilk: DC JACK | SERIAL | USBVCC | FTDI / RESET | GND | USBVCC | 5V | DC-DC CONV / EN | ICSP | GND | DC IN | DC JACK | RESET | GND | DC IN | PoE VIN | SKAARDUINO TestRig1
_bsilk: SERIAL | SERIAL | GND | USBVCC | 5V | POE- | POE+ | DC IN | GND | Spaced 0.6mm closer / together than SKAARDUINO | True footprint, / Tilt header post towards / edge